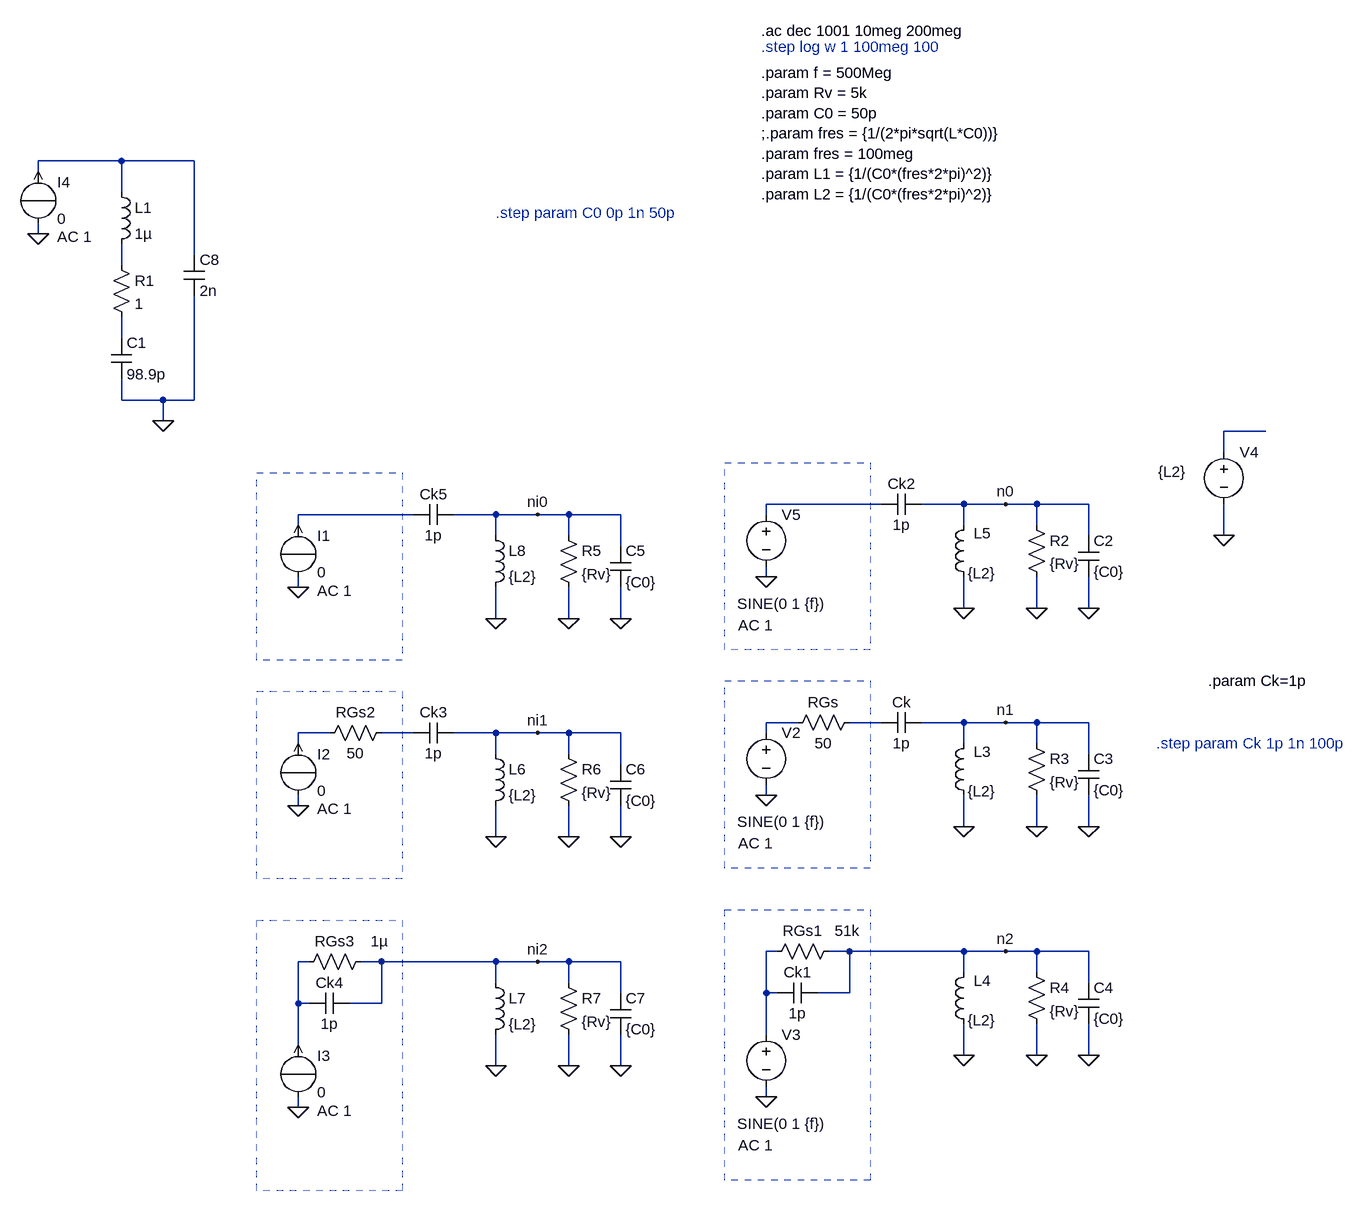
[diagram p0: schematic resonant_circuit_generator_coup_.asc]
resonant_circuit_generator_coup_.asc, the LTspice schematic file:
Version 4
SHEET 1 880 1076
WIRE -1696 -512 -1824 -512
WIRE -1584 -512 -1696 -512
WIRE -1824 -496 -1824 -512
WIRE -1696 -464 -1696 -512
WIRE -1824 -400 -1824 -416
WIRE -1584 -368 -1584 -512
WIRE -1696 -352 -1696 -384
WIRE -1696 -240 -1696 -272
WIRE -1696 -144 -1696 -176
WIRE -1632 -144 -1696 -144
WIRE -1584 -144 -1584 -304
WIRE -1584 -144 -1632 -144
WIRE -1632 -112 -1632 -144
WIRE 64 -96 0 -96
WIRE 0 -64 0 -96
WIRE -528 16 -704 16
WIRE -400 16 -464 16
WIRE -336 16 -400 16
WIRE -288 16 -336 16
WIRE -208 16 -288 16
WIRE -1248 32 -1424 32
WIRE -1120 32 -1184 32
WIRE -1056 32 -1120 32
WIRE -1008 32 -1056 32
WIRE -928 32 -1008 32
WIRE -704 32 -704 16
WIRE -1424 48 -1424 32
WIRE -400 48 -400 16
WIRE -288 48 -288 16
WIRE -1120 64 -1120 32
WIRE -1008 64 -1008 32
WIRE -208 64 -208 16
WIRE 0 64 0 16
WIRE -928 80 -928 32
WIRE -704 128 -704 112
WIRE -1424 144 -1424 128
WIRE -400 176 -400 128
WIRE -288 176 -288 128
WIRE -208 176 -208 128
WIRE -1120 192 -1120 144
WIRE -1008 192 -1008 144
WIRE -928 192 -928 144
WIRE -656 352 -704 352
WIRE -528 352 -576 352
WIRE -400 352 -464 352
WIRE -336 352 -400 352
WIRE -288 352 -336 352
WIRE -208 352 -288 352
WIRE -1376 368 -1424 368
WIRE -1248 368 -1296 368
WIRE -1120 368 -1184 368
WIRE -1056 368 -1120 368
WIRE -1008 368 -1056 368
WIRE -928 368 -1008 368
WIRE -704 368 -704 352
WIRE -1424 384 -1424 368
WIRE -400 384 -400 352
WIRE -288 384 -288 352
WIRE -1120 400 -1120 368
WIRE -1008 400 -1008 368
WIRE -208 400 -208 352
WIRE -928 416 -928 368
WIRE -704 464 -704 448
WIRE -1424 480 -1424 464
WIRE -400 512 -400 464
WIRE -288 512 -288 464
WIRE -208 512 -208 464
WIRE -1120 528 -1120 480
WIRE -1008 528 -1008 480
WIRE -928 528 -928 480
WIRE -688 704 -704 704
WIRE -576 704 -608 704
WIRE -400 704 -576 704
WIRE -336 704 -400 704
WIRE -288 704 -336 704
WIRE -208 704 -288 704
WIRE -1408 720 -1424 720
WIRE -1296 720 -1328 720
WIRE -1120 720 -1296 720
WIRE -1056 720 -1120 720
WIRE -1008 720 -1056 720
WIRE -928 720 -1008 720
WIRE -400 736 -400 704
WIRE -288 736 -288 704
WIRE -1120 752 -1120 720
WIRE -1008 752 -1008 720
WIRE -208 752 -208 704
WIRE -928 768 -928 720
WIRE -704 768 -704 704
WIRE -688 768 -704 768
WIRE -576 768 -576 704
WIRE -576 768 -624 768
WIRE -1424 784 -1424 720
WIRE -1408 784 -1424 784
WIRE -1296 784 -1296 720
WIRE -1296 784 -1344 784
WIRE -704 832 -704 768
WIRE -1424 848 -1424 784
WIRE -400 864 -400 816
WIRE -288 864 -288 816
WIRE -208 864 -208 816
WIRE -1120 880 -1120 832
WIRE -1008 880 -1008 832
WIRE -928 880 -928 832
WIRE -704 928 -704 912
WIRE -1424 944 -1424 928
FLAG -704 464 0
FLAG -400 512 0
FLAG -288 512 0
FLAG -208 512 0
FLAG -704 928 0
FLAG -400 864 0
FLAG -288 864 0
FLAG -208 864 0
FLAG -336 352 n1
FLAG -336 704 n2
FLAG 0 64 0
FLAG -704 128 0
FLAG -400 176 0
FLAG -288 176 0
FLAG -208 176 0
FLAG -336 16 n0
FLAG -1424 480 0
FLAG -1120 528 0
FLAG -1008 528 0
FLAG -928 528 0
FLAG -1424 944 0
FLAG -1120 880 0
FLAG -1008 880 0
FLAG -928 880 0
FLAG -1056 368 ni1
FLAG -1056 720 ni2
FLAG -1424 144 0
FLAG -1120 192 0
FLAG -1008 192 0
FLAG -928 192 0
FLAG -1056 32 ni0
FLAG -1632 -112 0
FLAG -1824 -400 0
SYMBOL voltage -704 352 R0
WINDOW 3 -45 153 Left 2
WINDOW 123 -43 186 Left 2
WINDOW 39 0 0 Left 2
SYMATTR Value SINE(0 1 {f})
SYMATTR Value2 AC 1
SYMATTR InstName V2
SYMBOL res -560 336 R90
WINDOW 0 0 56 VBottom 2
WINDOW 3 32 56 VTop 2
SYMATTR InstName RGs
SYMATTR Value 50
SYMBOL ind -384 480 R180
WINDOW 0 -26 83 Left 2
WINDOW 3 10 22 Right 2
SYMATTR InstName L3
SYMATTR Value {L2}
SYMBOL cap -464 336 R90
WINDOW 0 0 32 VBottom 2
WINDOW 3 32 32 VTop 2
SYMATTR InstName Ck
SYMATTR Value 1p
SYMBOL voltage -704 816 R0
WINDOW 3 -45 153 Left 2
WINDOW 123 -43 186 Left 2
WINDOW 39 0 0 Left 2
SYMATTR Value SINE(0 1 {f})
SYMATTR Value2 AC 1
SYMATTR InstName V3
SYMBOL res -592 688 R90
WINDOW 0 0 56 VBottom 2
WINDOW 3 0 -13 VBottom 2
SYMATTR InstName RGs1
SYMATTR Value 51k
SYMBOL cap -624 752 R90
WINDOW 0 0 32 VBottom 2
WINDOW 3 32 32 VTop 2
SYMATTR InstName Ck1
SYMATTR Value 1p
SYMBOL ind -384 832 R180
WINDOW 0 -26 83 Left 2
WINDOW 3 10 22 Right 2
SYMATTR InstName L4
SYMATTR Value {L2}
SYMBOL voltage 0 -80 R0
WINDOW 3 -101 46 Left 2
WINDOW 123 -43 186 Left 2
WINDOW 39 0 0 Left 2
SYMATTR Value {L2}
SYMATTR InstName V4
SYMBOL voltage -704 16 R0
WINDOW 3 -45 153 Left 2
WINDOW 123 -43 186 Left 2
WINDOW 39 0 0 Left 2
SYMATTR Value SINE(0 1 {f})
SYMATTR Value2 AC 1
SYMATTR InstName V5
SYMBOL ind -384 144 R180
WINDOW 0 -26 83 Left 2
WINDOW 3 10 22 Right 2
SYMATTR InstName L5
SYMATTR Value {L2}
SYMBOL cap -464 0 R90
WINDOW 0 0 32 VBottom 2
WINDOW 3 32 32 VTop 2
SYMATTR InstName Ck2
SYMATTR Value 1p
SYMBOL res -304 32 R0
SYMATTR InstName R2
SYMATTR Value {Rv}
SYMBOL cap -224 64 R0
SYMATTR InstName C2
SYMATTR Value {C0}
SYMBOL res -304 368 R0
SYMATTR InstName R3
SYMATTR Value {Rv}
SYMBOL cap -224 400 R0
SYMATTR InstName C3
SYMATTR Value {C0}
SYMBOL res -304 720 R0
SYMATTR InstName R4
SYMATTR Value {Rv}
SYMBOL cap -224 752 R0
SYMATTR InstName C4
SYMATTR Value {C0}
SYMBOL res -1280 352 R90
WINDOW 0 0 56 VBottom 2
WINDOW 3 32 56 VTop 2
SYMATTR InstName RGs2
SYMATTR Value 50
SYMBOL ind -1136 384 R0
SYMATTR InstName L6
SYMATTR Value {L2}
SYMBOL cap -1184 352 R90
WINDOW 0 0 32 VBottom 2
WINDOW 3 32 32 VTop 2
SYMATTR InstName Ck3
SYMATTR Value 1p
SYMBOL res -1312 704 R90
WINDOW 0 0 56 VBottom 2
WINDOW 3 0 -13 VBottom 2
SYMATTR InstName RGs3
SYMATTR Value 1µ
SYMBOL cap -1344 768 R90
WINDOW 0 0 32 VBottom 2
WINDOW 3 32 32 VTop 2
SYMATTR InstName Ck4
SYMATTR Value 1p
SYMBOL ind -1136 736 R0
SYMATTR InstName L7
SYMATTR Value {L2}
SYMBOL ind -1136 48 R0
SYMATTR InstName L8
SYMATTR Value {L2}
SYMBOL cap -1184 16 R90
WINDOW 0 0 32 VBottom 2
WINDOW 3 32 32 VTop 2
SYMATTR InstName Ck5
SYMATTR Value 1p
SYMBOL res -1024 48 R0
SYMATTR InstName R5
SYMATTR Value {Rv}
SYMBOL cap -944 80 R0
SYMATTR InstName C5
SYMATTR Value {C0}
SYMBOL res -1024 384 R0
SYMATTR InstName R6
SYMATTR Value {Rv}
SYMBOL cap -944 416 R0
SYMATTR InstName C6
SYMATTR Value {C0}
SYMBOL res -1024 736 R0
SYMATTR InstName R7
SYMATTR Value {Rv}
SYMBOL cap -944 768 R0
SYMATTR InstName C7
SYMATTR Value {C0}
SYMBOL source-I -1424 48 R0
WINDOW 123 29 101 Left 2
WINDOW 39 0 0 Left 2
SYMATTR InstName I1
SYMATTR Value 0
SYMATTR Value2 AC 1
SYMBOL source-I -1424 384 R0
WINDOW 123 29 101 Left 2
WINDOW 39 0 0 Left 2
SYMATTR InstName I2
SYMATTR Value 0
SYMATTR Value2 AC 1
SYMBOL source-I -1424 848 R0
WINDOW 123 29 101 Left 2
WINDOW 39 0 0 Left 2
SYMATTR InstName I3
SYMATTR Value 0
SYMATTR Value2 AC 1
SYMBOL res -1712 -368 R0
SYMATTR InstName R1
SYMATTR Value 1
SYMBOL ind -1712 -480 R0
SYMATTR InstName L1
SYMATTR Value 1µ
SYMBOL cap -1712 -240 R0
SYMATTR InstName C1
SYMATTR Value 98.9p
SYMBOL cap -1600 -368 R0
SYMATTR InstName C8
SYMATTR Value 2n
SYMBOL source-I -1824 -496 R0
WINDOW 123 29 101 Left 2
WINDOW 39 0 0 Left 2
SYMATTR InstName I4
SYMATTR Value 0
SYMATTR Value2 AC 1
TEXT -712 -712 Left 2 !.ac dec 1001 10meg 200meg
TEXT -712 -648 Left 2 !.param f = 500Meg\n.param Rv = 5k\n.param C0 = 50p\n;.param fres = {1/(2*pi*sqrt(L*C0))}\n.param fres = 100meg\n.param L1 = {1/(C0*(fres*2*pi)^2)}\n.param L2 = {1/(C0*(fres*2*pi)^2)}
TEXT -712 -688 Left 2 ;.step log w 1 100meg 100
TEXT -24 288 Left 2 !.param Ck=1p
TEXT -104 384 Left 2 ;.step param Ck 1p 1n 100p
TEXT -1120 -432 Left 2 ;.step param C0 0p 1n 50p
RECTANGLE Normal -544 576 -768 288 2
RECTANGLE Normal -544 1056 -768 640 2
RECTANGLE Normal -544 240 -768 -48 2
RECTANGLE Normal -1264 592 -1488 304 2
RECTANGLE Normal -1264 1072 -1488 656 2
RECTANGLE Normal -1264 256 -1488 -32 2

The netlist it stands for:
* resonant_circuit_generator_coup_.asc
V2 N007 0 SINE(0 1 {f}) AC 1
RGs N008 N007 50
L3 0 n1 {L2}
Ck n1 N008 1p
V3 N011 0 SINE(0 1 {f}) AC 1
RGs1 n2 N011 51k
Ck1 n2 N011 1p
L4 0 n2 {L2}
V4 N004 0 {L2}
V5 N005 0 SINE(0 1 {f}) AC 1
L5 0 n0 {L2}
Ck2 n0 N005 1p
R2 n0 0 {Rv}
C2 n0 0 {C0}
R3 n1 0 {Rv}
C3 n1 0 {C0}
R4 n2 0 {Rv}
C4 n2 0 {C0}
RGs2 N010 N009 50
L6 ni1 0 {L2}
Ck3 ni1 N010 1p
RGs3 ni2 N012 1µ
Ck4 ni2 N012 1p
L7 ni2 0 {L2}
L8 ni0 0 {L2}
Ck5 ni0 N006 1p
R5 ni0 0 {Rv}
C5 ni0 0 {C0}
R6 ni1 0 {Rv}
C6 ni1 0 {C0}
R7 ni2 0 {Rv}
C7 ni2 0 {C0}
I1 0 N006 0 AC 1
I2 0 N009 0 AC 1
I3 0 N012 0 AC 1
R1 N002 N003 1
L1 N001 N002 1µ
C1 N003 0 98.9p
C8 N001 0 2n
I4 0 N001 0 AC 1
.ac dec 1001 10meg 200meg
.param f = 500Meg
.param Rv = 5k
.param C0 = 50p
;.param fres = {1/(2*pi*sqrt(L*C0))}
.param fres = 100meg
.param L1 = {1/(C0*(fres*2*pi)^2)}
.param L2 = {1/(C0*(fres*2*pi)^2)}
* .step log w 1 100meg 100
.param Ck=1p
* .step param Ck 1p 1n 100p
* .step param C0 0p 1n 50p
.backanno
.end